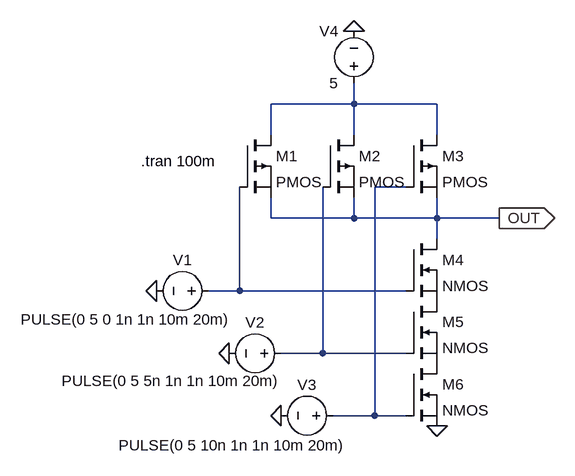
[diagram p0: schematic 3 IN-NAND.asc]
3 IN-NAND.asc, the LTspice schematic file:
Version 4.1
SHEET 1 880 680
WIRE 256 32 256 0
WIRE 256 32 128 32
WIRE 384 32 256 32
WIRE 128 80 128 32
WIRE 256 80 256 32
WIRE 384 80 384 32
WIRE 336 160 288 160
WIRE 128 208 128 176
WIRE 256 208 256 176
WIRE 256 208 128 208
WIRE 384 208 384 176
WIRE 384 208 256 208
WIRE 480 208 384 208
WIRE 384 240 384 208
WIRE 80 320 80 160
WIRE 80 320 32 320
WIRE 336 320 80 320
WIRE 208 416 208 160
WIRE 208 416 144 416
WIRE 336 416 208 416
WIRE 288 512 288 160
WIRE 288 512 224 512
WIRE 336 512 288 512
FLAG 480 208 OUT
IOPIN 480 208 Out
FLAG -48 320 0
FLAG 64 416 0
FLAG 144 512 0
FLAG 256 -80 0
FLAG 384 528 0
SYMBOL pmos 80 80 R0
SYMATTR InstName M1
SYMBOL pmos 208 80 R0
SYMATTR InstName M2
SYMBOL pmos 336 80 R0
SYMATTR InstName M3
SYMBOL nmos 336 240 R0
SYMATTR InstName M4
SYMBOL nmos 336 336 R0
SYMATTR InstName M5
SYMBOL nmos 336 432 R0
SYMATTR InstName M6
SYMBOL voltage 48 320 R90
WINDOW 0 -32 56 VBottom 2
WINDOW 3 28 143 VTop 2
WINDOW 123 0 0 Left 0
WINDOW 39 0 0 Left 0
SYMATTR InstName V1
SYMATTR Value PULSE(0 5 0 1n 1n 10m 20m)
SYMBOL voltage 160 416 R90
WINDOW 0 -32 56 VBottom 2
WINDOW 3 27 185 VTop 2
WINDOW 123 0 0 Left 0
WINDOW 39 0 0 Left 0
SYMATTR InstName V2
SYMATTR Value PULSE(0 5 5n 1n 1n 10m 20m)
SYMBOL voltage 240 512 R90
WINDOW 0 -32 56 VBottom 2
WINDOW 3 30 171 VTop 2
WINDOW 123 0 0 Left 0
WINDOW 39 0 0 Left 0
SYMATTR InstName V3
SYMATTR Value PULSE(0 5 10n 1n 1n 10m 20m)
SYMBOL voltage 256 16 R180
WINDOW 0 24 96 Left 2
WINDOW 3 24 16 Left 2
WINDOW 123 0 0 Left 0
WINDOW 39 0 0 Left 0
SYMATTR InstName V4
SYMATTR Value 5
TEXT -72 120 Left 2 !.tran 100m

The netlist it stands for:
* 3 IN-NAND.asc
M1 N001 N003 OUT OUT PMOS
M2 N001 N004 OUT OUT PMOS
M3 N001 N002 OUT OUT PMOS
M4 OUT N003 P001 P001 NMOS
M5 P001 N004 P002 P002 NMOS
M6 P002 N002 0 0 NMOS
V1 N003 0 PULSE(0 5 0 1n 1n 10m 20m)
V2 N004 0 PULSE(0 5 5n 1n 1n 10m 20m)
V3 N002 0 PULSE(0 5 10n 1n 1n 10m 20m)
V4 N001 0 5
.model NMOS NMOS
.model PMOS PMOS
.lib standard.mos
.tran 100m
.backanno
.end